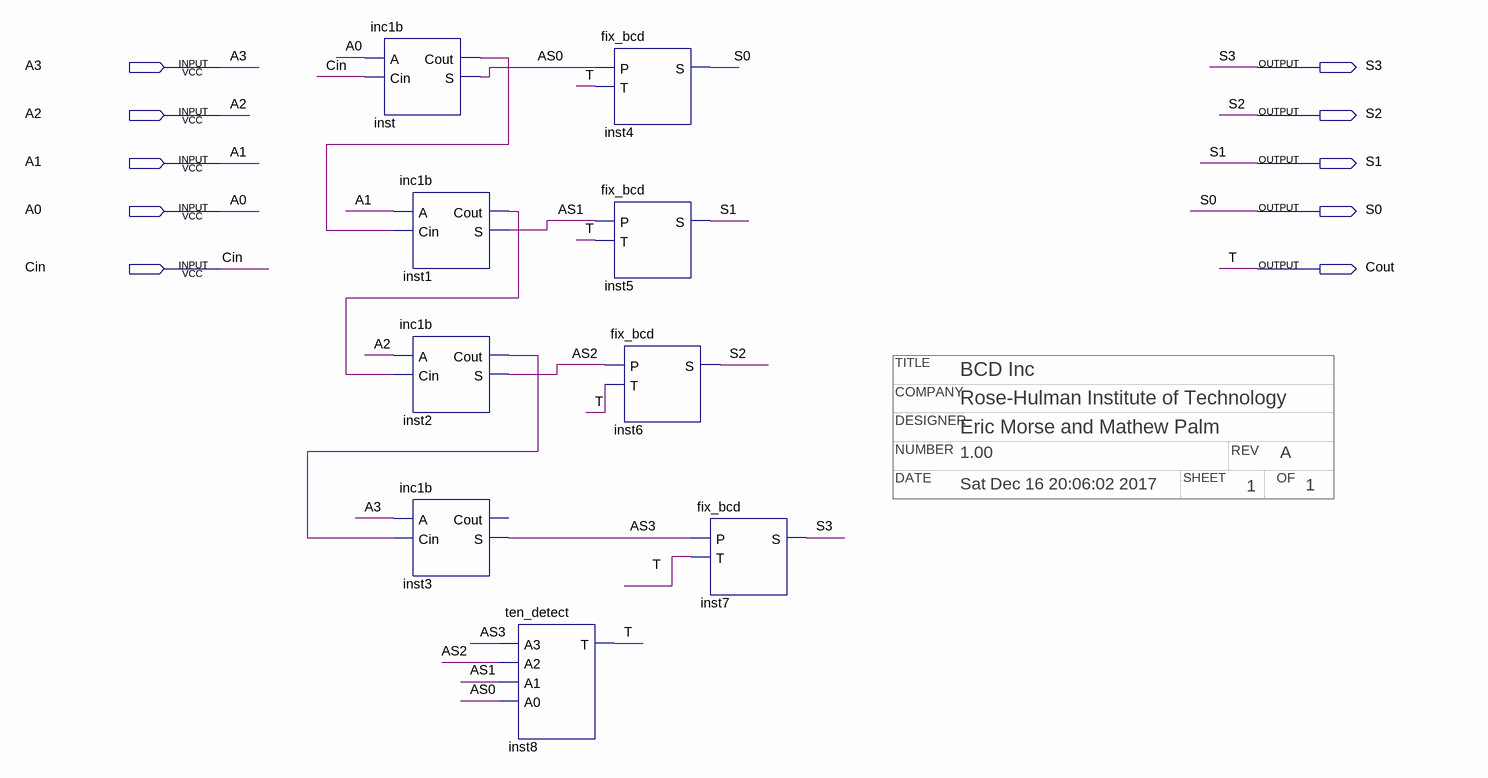
[diagram p0: schematic sheet]
// Quartus schematic bcd_inc.bdf as structural Verilog: 9 symbols, 10 pins
// Title block: COMPANY: Rose-Hulman Institute of Technology; DATE: Sat Dec 16 20:06:02 2017; DESIGNER: Eric Morse and Mathew Palm; NUMBER: 1.00; OF: 1; REV: A; SHEET: 1; TITLE: BCD Inc
module bcd_inc (
  input  A3,
  input  A2,
  input  A1,
  input  A0,
  input  Cin,
  output S3,
  output S2,
  output S1,
  output S0,
  output Cout
);

  wire AS0, AS1, AS2, AS3, inst1_cout, inst2_cout, inst_cout;

  inc1b inst (.A(A0), .Cin(Cin), .Cout(inst_cout), .S(AS0));
  inc1b inst1 (.A(A1), .Cin(inst_cout), .Cout(inst1_cout), .S(AS1));
  inc1b inst2 (.A(A2), .Cin(inst1_cout), .Cout(inst2_cout), .S(AS2));
  inc1b inst3 (.A(A3), .Cin(inst2_cout), .S(AS3));  // open: Cout
  ten_detect inst8 (.A3(AS3), .A2(AS2), .A1(AS1), .A0(AS0), .T(Cout));
  fix_bcd inst4 (.P(AS0), .T(Cout), .S(S0));
  fix_bcd inst5 (.P(AS1), .T(Cout), .S(S1));
  fix_bcd inst6 (.P(AS2), .T(Cout), .S(S2));
  fix_bcd inst7 (.P(AS3), .T(Cout), .S(S3));

  // Other names for the same wires on the sheet: T = Cout
endmodule
